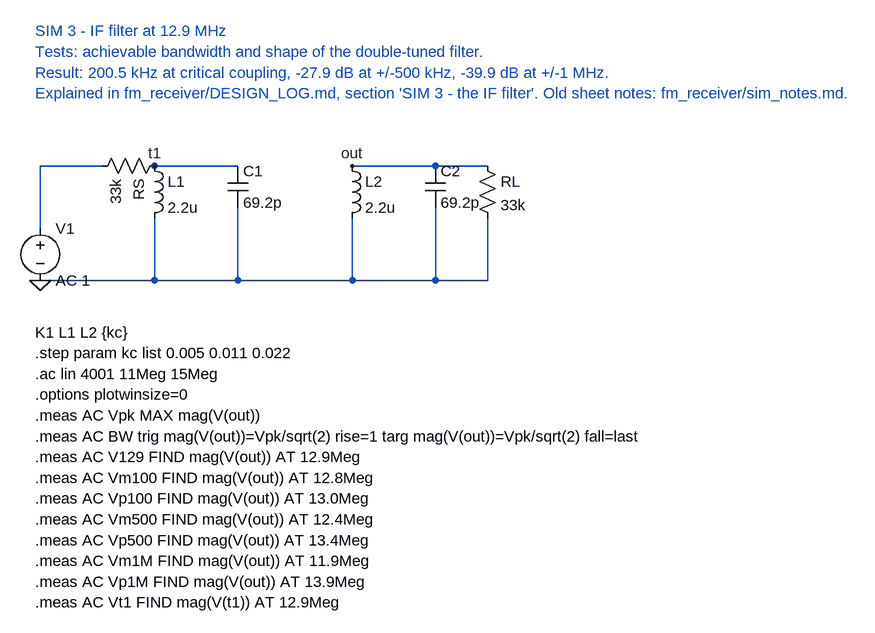
[diagram p0: schematic sim3_if_filter.asc]
sim3_if_filter.asc, the LTspice schematic file:
Version 4
SHEET 1 1400 900
WIRE 80 240 80 144
WIRE 80 144 176 144
WIRE 256 144 384 144
WIRE 256 224 256 320
WIRE 384 208 384 320
WIRE 560 144 768 144
WIRE 560 224 560 320
WIRE 688 208 688 320
WIRE 768 224 768 320
WIRE 80 320 256 320
WIRE 256 320 384 320
WIRE 384 320 560 320
WIRE 560 320 688 320
WIRE 688 320 768 320
FLAG 80 320 0
FLAG 256 144 t1
FLAG 560 144 out
SYMBOL voltage 80 224 R0
SYMATTR InstName V1
SYMATTR Value AC 1
SYMBOL res 272 128 R90
SYMATTR InstName RS
SYMATTR Value 33k
SYMBOL ind 240 128 R0
SYMATTR InstName L1
SYMATTR Value 2.2u
SYMATTR SpiceLine Rser=1
SYMBOL cap 368 144 R0
SYMATTR InstName C1
SYMATTR Value 69.2p
SYMBOL ind 544 128 R0
SYMATTR InstName L2
SYMATTR Value 2.2u
SYMATTR SpiceLine Rser=1
SYMBOL cap 672 144 R0
SYMATTR InstName C2
SYMATTR Value 69.2p
SYMBOL res 752 128 R0
SYMATTR InstName RL
SYMATTR Value 33k
TEXT 72 400 Left 2 !K1 L1 L2 {kc}
TEXT 72 432 Left 2 !.step param kc list 0.005 0.011 0.022
TEXT 72 464 Left 2 !.ac lin 4001 11Meg 15Meg
TEXT 72 496 Left 2 !.options plotwinsize=0
TEXT 72 528 Left 2 !.meas AC Vpk MAX mag(V(out))
TEXT 72 560 Left 2 !.meas AC BW trig mag(V(out))=Vpk/sqrt(2) rise=1 targ mag(V(out))=Vpk/sqrt(2) fall=last
TEXT 72 592 Left 2 !.meas AC V129 FIND mag(V(out)) AT 12.9Meg
TEXT 72 624 Left 2 !.meas AC Vm100 FIND mag(V(out)) AT 12.8Meg
TEXT 72 656 Left 2 !.meas AC Vp100 FIND mag(V(out)) AT 13.0Meg
TEXT 72 688 Left 2 !.meas AC Vm500 FIND mag(V(out)) AT 12.4Meg
TEXT 72 720 Left 2 !.meas AC Vp500 FIND mag(V(out)) AT 13.4Meg
TEXT 72 752 Left 2 !.meas AC Vm1M FIND mag(V(out)) AT 11.9Meg
TEXT 72 784 Left 2 !.meas AC Vp1M FIND mag(V(out)) AT 13.9Meg
TEXT 72 816 Left 2 !.meas AC Vt1 FIND mag(V(t1)) AT 12.9Meg
TEXT 72 -64 Left 2 ;SIM 3 - IF filter at 12.9 MHz
TEXT 72 -32 Left 2 ;Tests: achievable bandwidth and shape of the double-tuned filter.
TEXT 72 0 Left 2 ;Result: 200.5 kHz at critical coupling, -27.9 dB at +/-500 kHz, -39.9 dB at +/-1 MHz.
TEXT 72 32 Left 2 ;Explained in fm_receiver/DESIGN_LOG.md, section 'SIM 3 - the IF filter'. Old sheet notes: fm_receiver/sim_notes.md.

The netlist it stands for:
* sim3_if_filter.asc
V1 N001 0 AC 1
RS t1 N001 33k
L1 t1 0 2.2u Rser=1
C1 t1 0 69.2p
L2 out 0 2.2u Rser=1
C2 out 0 69.2p
RL out 0 33k
K1 L1 L2 {kc}
.step param kc list 0.005 0.011 0.022
.ac lin 4001 11Meg 15Meg
.options plotwinsize=0
.meas AC Vpk MAX mag(V(out))
.meas AC BW trig mag(V(out))=Vpk/sqrt(2) rise=1 targ mag(V(out))=Vpk/sqrt(2) fall=last
.meas AC V129 FIND mag(V(out)) AT 12.9Meg
.meas AC Vm100 FIND mag(V(out)) AT 12.8Meg
.meas AC Vp100 FIND mag(V(out)) AT 13.0Meg
.meas AC Vm500 FIND mag(V(out)) AT 12.4Meg
.meas AC Vp500 FIND mag(V(out)) AT 13.4Meg
.meas AC Vm1M FIND mag(V(out)) AT 11.9Meg
.meas AC Vp1M FIND mag(V(out)) AT 13.9Meg
.meas AC Vt1 FIND mag(V(t1)) AT 12.9Meg
* SIM 3 - IF filter at 12.9 MHz
* Tests: achievable bandwidth and shape of the double-tuned filter.
* Result: 200.5 kHz at critical coupling, -27.9 dB at +/-500 kHz, -39.9 dB at +/-1 MHz.
* Explained in fm_receiver/DESIGN_LOG.md, section 'SIM 3 - the IF filter'. Old sheet notes: fm_receiver/sim_notes.md.
.backanno
.end